# Altium schematic sheet Havashenasi.SchDoc
size A3
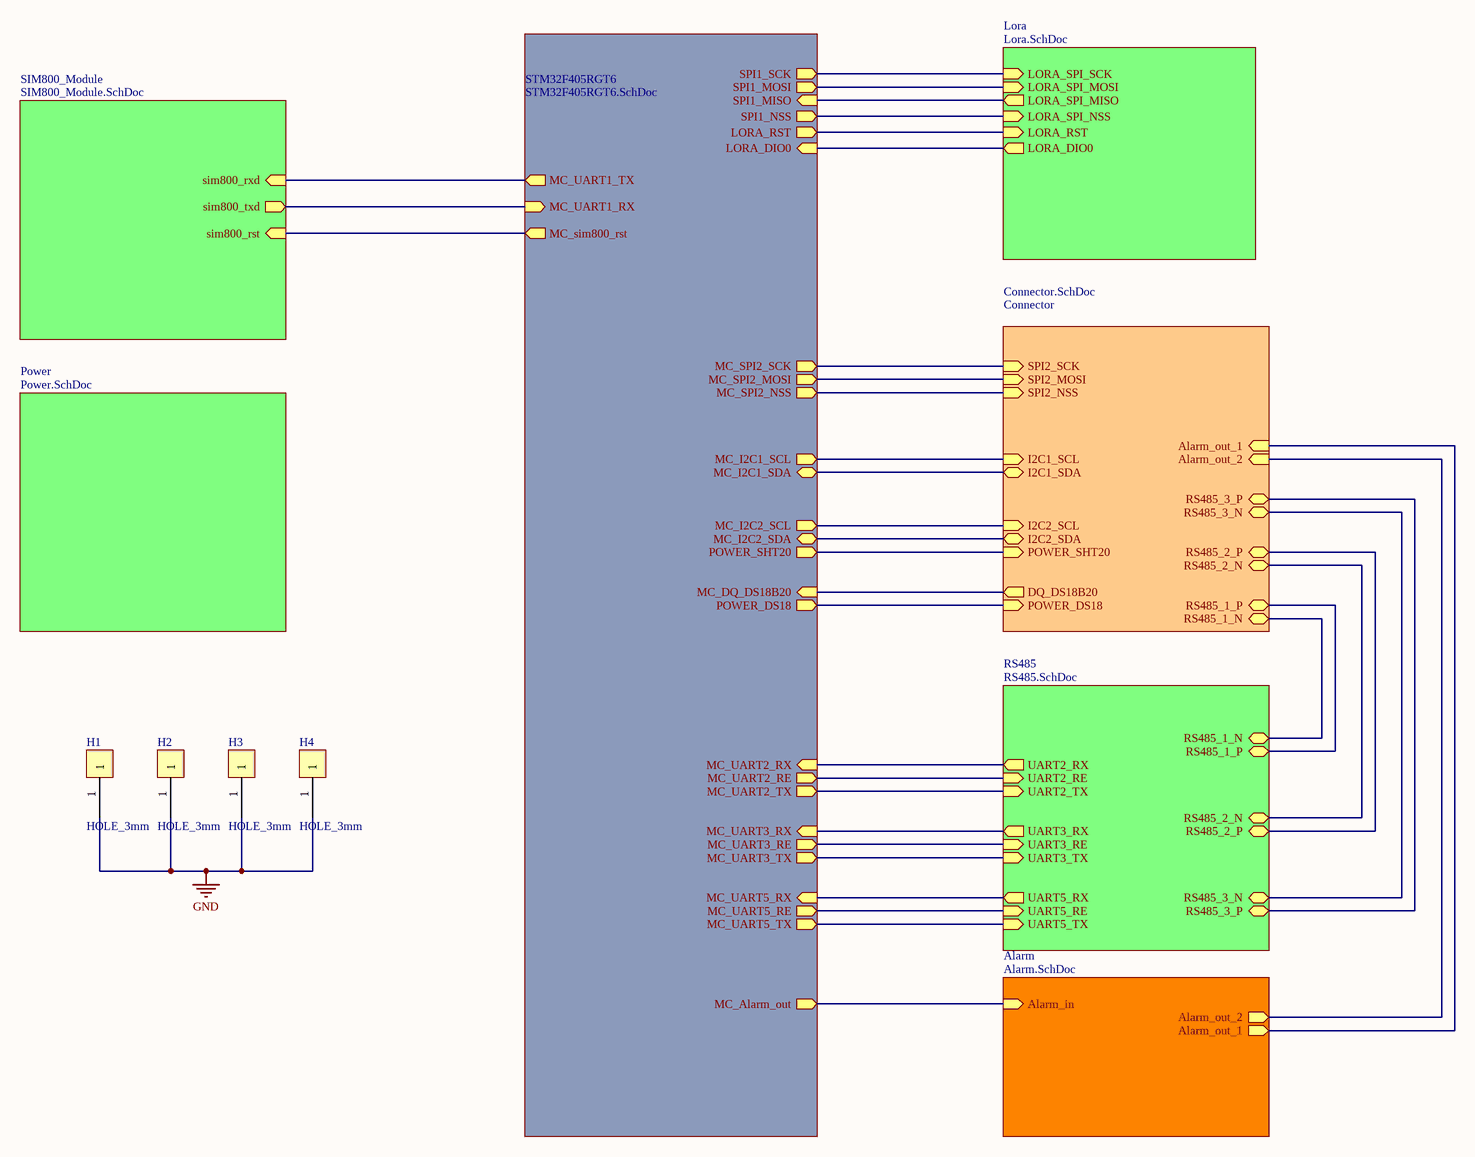
[diagram p0: Havashenasi.SchDoc]

## Parts
H1  HOLE_3mm  [Hole_3mm]
H2  HOLE_3mm  [Hole_3mm]
H3  HOLE_3mm  [Hole_3mm]
H4  HOLE_3mm  [Hole_3mm]

## Sub-sheets
Alarm = Alarm.SchDoc: Alarm_out_2 (out), Alarm_out_1 (out), Alarm_in (in)
Connector = Connector.SchDoc: I2C2_SDA (bidir), I2C2_SCL (in), I2C1_SDA (bidir), I2C1_SCL (in), RS485_1_P (bidir), RS485_1_N (bidir), RS485_2_P (bidir), RS485_2_N (bidir), RS485_3_P (bidir), RS485_3_N (bidir), DQ_DS18B20 (out), Alarm_out_2 (in), Alarm_out_1 (in), SPI2_SCK (in), SPI2_MOSI (in), SPI2_NSS (in), POWER_SHT20 (in), POWER_DS18 (in)
Lora = Lora.SchDoc: LORA_SPI_MISO (out), LORA_RST (in), LORA_SPI_MOSI (in), LORA_SPI_SCK (in), LORA_SPI_NSS (in), LORA_DIO0 (out)
Power = Power.SchDoc: no entries
RS485 = RS485.SchDoc: UART3_RE (in), RS485_1_N (bidir), UART5_RE (in), UART2_TX (in), RS485_1_P (bidir), UART2_RE (in), UART3_TX (in), RS485_2_P (bidir), UART3_RX (out), RS485_2_N (bidir), UART2_RX (out), RS485_3_N (bidir), RS485_3_P (bidir), UART5_RX (out), UART5_TX (in)
SIM800_Module = SIM800_Module.SchDoc: sim800_rxd (in), sim800_txd (out), sim800_rst (in)
STM32F405RGT6 = STM32F405RGT6.SchDoc: MC_I2C2_SCL (out), MC_I2C2_SDA (bidir), MC_UART1_TX (out), MC_UART1_RX (in), MC_I2C1_SCL (out), MC_I2C1_SDA (bidir), MC_UART2_TX (out), MC_UART2_RX (in), MC_UART3_TX (out), MC_UART3_RX (in), MC_UART5_TX (out), MC_UART5_RX (in), MC_UART3_RE (out), MC_UART2_RE (out), MC_UART5_RE (out), MC_sim800_rst (out), MC_DQ_DS18B20 (in), MC_Alarm_out (out), MC_SPI2_MOSI (out), MC_SPI2_SCK (out), MC_SPI2_NSS (out), POWER_DS18 (out), POWER_SHT20 (out), SPI1_NSS (out), SPI1_SCK (out), SPI1_MISO (in), SPI1_MOSI (out), LORA_RST (out), LORA_DIO0 (in)

## Nets
GND: H1.1 H2.1 H3.1 H4.1
(unnamed): sheet STM32F405RGT6/MC_I2C2_SCL, sheet Connector/I2C2_SCL
(unnamed): sheet STM32F405RGT6/MC_I2C2_SDA, sheet Connector/I2C2_SDA
(unnamed): sheet STM32F405RGT6/MC_UART1_TX, sheet SIM800_Module/sim800_rxd
(unnamed): sheet STM32F405RGT6/MC_UART1_RX, sheet SIM800_Module/sim800_txd
(unnamed): sheet STM32F405RGT6/MC_I2C1_SCL, sheet Connector/I2C1_SCL
(unnamed): sheet STM32F405RGT6/MC_I2C1_SDA, sheet Connector/I2C1_SDA
(unnamed): sheet STM32F405RGT6/MC_UART2_TX, sheet RS485/UART2_TX
(unnamed): sheet STM32F405RGT6/MC_UART2_RX, sheet RS485/UART2_RX
(unnamed): sheet STM32F405RGT6/MC_UART3_TX, sheet RS485/UART3_TX
(unnamed): sheet STM32F405RGT6/MC_UART3_RX, sheet RS485/UART3_RX
(unnamed): sheet STM32F405RGT6/MC_UART5_TX, sheet RS485/UART5_TX
(unnamed): sheet STM32F405RGT6/MC_UART5_RX, sheet RS485/UART5_RX
(unnamed): sheet STM32F405RGT6/MC_UART3_RE, sheet RS485/UART3_RE
(unnamed): sheet STM32F405RGT6/MC_UART2_RE, sheet RS485/UART2_RE
(unnamed): sheet STM32F405RGT6/MC_UART5_RE, sheet RS485/UART5_RE
(unnamed): sheet STM32F405RGT6/MC_sim800_rst, sheet SIM800_Module/sim800_rst
(unnamed): sheet STM32F405RGT6/MC_DQ_DS18B20, sheet Connector/DQ_DS18B20
(unnamed): sheet STM32F405RGT6/MC_Alarm_out, sheet Alarm/Alarm_in
(unnamed): sheet STM32F405RGT6/MC_SPI2_MOSI, sheet Connector/SPI2_MOSI
(unnamed): sheet STM32F405RGT6/MC_SPI2_SCK, sheet Connector/SPI2_SCK
(unnamed): sheet STM32F405RGT6/MC_SPI2_NSS, sheet Connector/SPI2_NSS
(unnamed): sheet STM32F405RGT6/POWER_DS18, sheet Connector/POWER_DS18
(unnamed): sheet STM32F405RGT6/POWER_SHT20, sheet Connector/POWER_SHT20
(unnamed): sheet STM32F405RGT6/SPI1_NSS, sheet Lora/LORA_SPI_NSS
(unnamed): sheet STM32F405RGT6/SPI1_SCK, sheet Lora/LORA_SPI_SCK
(unnamed): sheet STM32F405RGT6/SPI1_MISO, sheet Lora/LORA_SPI_MISO
(unnamed): sheet STM32F405RGT6/SPI1_MOSI, sheet Lora/LORA_SPI_MOSI
(unnamed): sheet STM32F405RGT6/LORA_RST, sheet Lora/LORA_RST
(unnamed): sheet STM32F405RGT6/LORA_DIO0, sheet Lora/LORA_DIO0
(unnamed): sheet Connector/RS485_1_P, sheet RS485/RS485_1_P
(unnamed): sheet Connector/RS485_1_N, sheet RS485/RS485_1_N
(unnamed): sheet Connector/RS485_2_P, sheet RS485/RS485_2_P
(unnamed): sheet Connector/RS485_2_N, sheet RS485/RS485_2_N
(unnamed): sheet Connector/RS485_3_P, sheet RS485/RS485_3_P
(unnamed): sheet Connector/RS485_3_N, sheet RS485/RS485_3_N
(unnamed): sheet Connector/Alarm_out_2, sheet Alarm/Alarm_out_2
(unnamed): sheet Connector/Alarm_out_1, sheet Alarm/Alarm_out_1